# Altium schematic sheet AMP.SchDoc
size A4
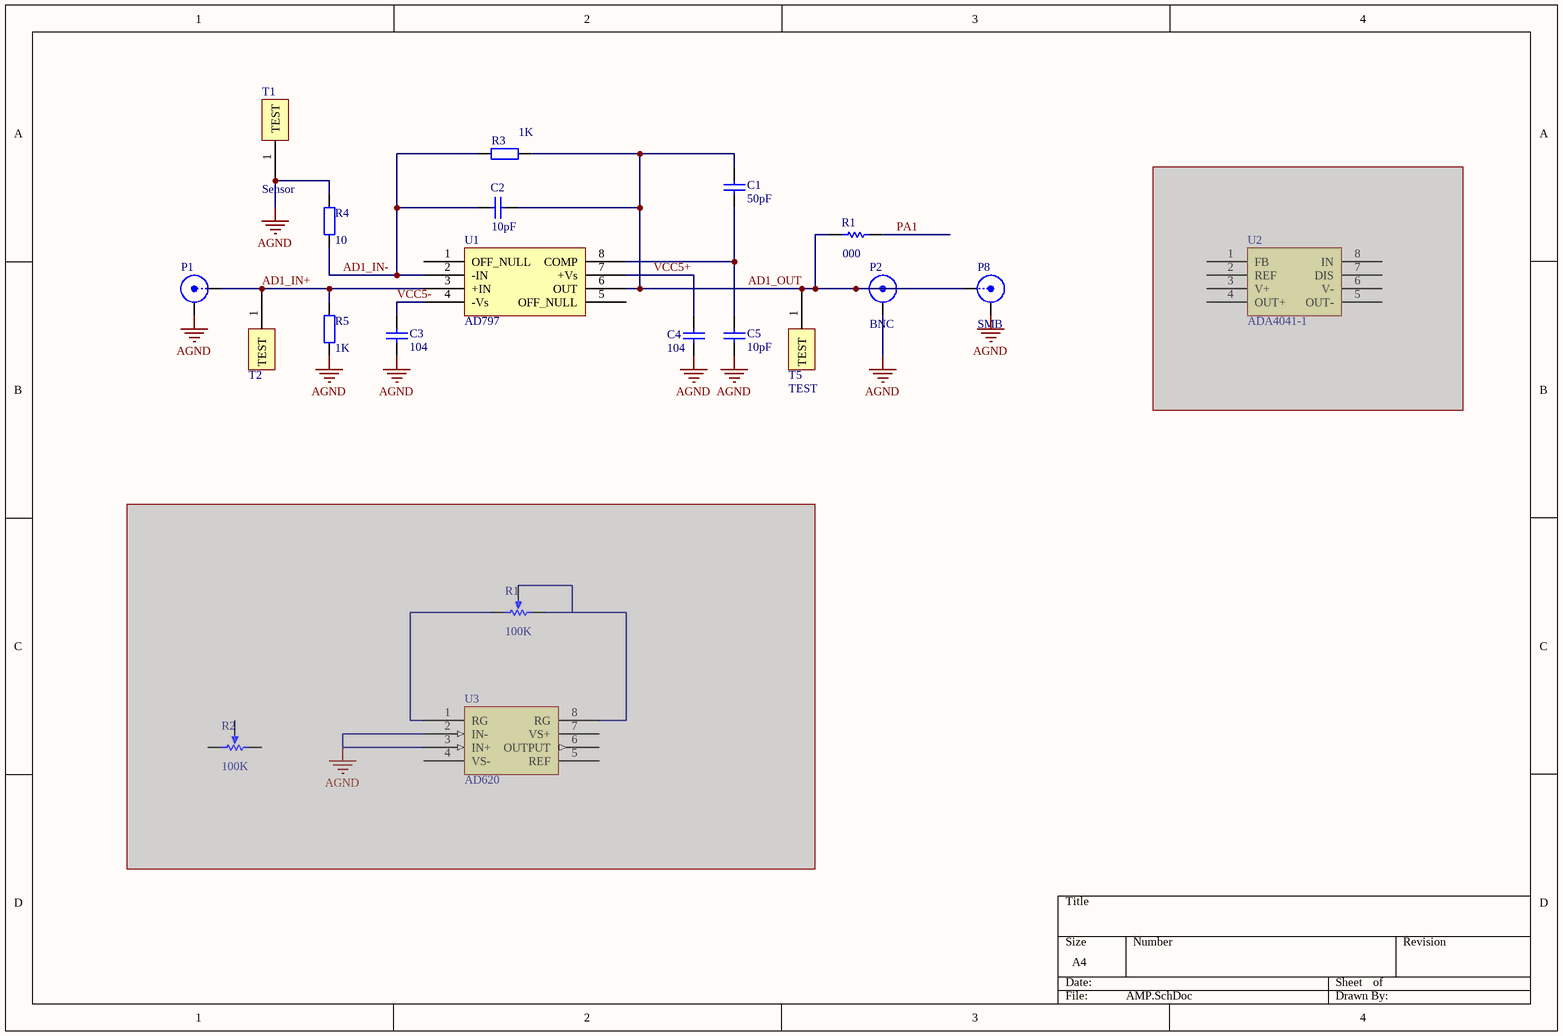
[diagram p0: AMP.SchDoc]

## Parts
(Parts that share a designator on the sheet are numbered #1, #2 ... from top to bottom, then left to right.)
C1  value 50pF  [1206]  (hidden comment: Cap)
C2  value 10pF  [1206]  (hidden comment: Cap)
C3  value 104  [1206]  (hidden comment: Cap)
C4  value 104  [1206]  (hidden comment: Cap)
C5  value 10pF  [1206]  (hidden comment: Cap)
P1  SMB  [SMB_V-RJ45]  (value not drawn)
P2  BNC  [BNC_RA CON]
P8  SMB  [SMB_V-RJ45]
R1#1  value 000  [1206]  (hidden comment: Res Semi)
R1#2  value 100K  [VR5]  (hidden comment: RPot)  (masked out: inside a compile mask, not in the netlist)
R2  value 100K  [VR5]  (hidden comment: RPot)  (masked out: inside a compile mask, not in the netlist)
R3  value 1K  [1206]  (hidden comment: Res2)
R4  value 10  [1206]  (hidden comment: Res2)
R5  value 1K  [1206]  (hidden comment: Res2)
T1  Sensor  [TEST_2]
T2  Sensor  [TEST_2]  (value not drawn)
T5  TEST  [TEST]
U1  AD797  [SO8]
U2  ADA4041-1  [SO8]  (masked out: inside a compile mask, not in the netlist)
U3  AD620  [SO8]  (masked out: inside a compile mask, not in the netlist)

## Nets
AGND: C3.2 C4.2 C5.2 P1.2(Y) P2.2(Y) P8.2(Y) R4.2 R5.1 T1.1(TEST)
AD1_IN+: P1.1(X) R5.2 T2.1(TEST) U1.3(+IN)
AD1_IN-: C2.2 R3.2 R4.1 U1.2(-IN)
AD1_OUT: C1.1 C2.1 P2.1(X) P8.1(X) R1#1.1 R3.1 T5.1(TEST) U1.6(OUT)
PA1: R1#1.2
VCC5+: C4.1 U1.7(+Vs)
VCC5-: C3.1 U1.4(-Vs)
NetC1_2: C1.2 C5.1 U1.8(COMP)

Not connected (* = marked no-connect by the designer): U1 1(OFF_NULL) 5(OFF_NULL)

## Library data of the parts
C1-C5 = Cap: Capacitor; Published: 8-Jun-2000; LatestRevisionDate: 17-Jul-2002; LatestRevisionNote: Re-released for DXP Platform.; PackageReference: RAD-0.3; Publisher: Altium Limited
P1 P8 = SMB: SMB Straight Connector; LatestRevisionDate: 17-Jul-2002; LatestRevisionNote: Re-released for DXP Platform.; Publisher: Altium Limited
P2 = BNC: BNC Elbow Connector; LatestRevisionDate: 17-Jul-2002; LatestRevisionNote: Re-released for DXP Platform.; Publisher: Altium Limited
R1#1 = Res Semi: Semiconductor Resistor; Published: 8-Jun-2000; LatestRevisionDate: 17-Jul-2002; LatestRevisionNote: Re-released for DXP Platform.; PackageReference: AXIAL-0.5; Publisher: Altium Limited
R1#2 R2 = RPot: Potentiometer; Sim Note: Enter the Resistance value and the set point into parameter fields.; Set Position: 0.5; Published: 8-Jun-2000; LatestRevisionDate: 17-Jul-2002; LatestRevisionNote: Re-released for DXP Platform.; PackageReference: VR5; Publisher: Altium Limited
R3-R5 = Res2: Resistor; Published: 8-Jun-2000; LatestRevisionDate: 17-Jul-2002; LatestRevisionNote: Re-released for DXP Platform.; PackageReference: AXIAL-0.4; Publisher: Altium Limited
T1 T2 = TEST